# Altium schematic sheet fpgaB35.SchDoc
size A2; SheetNumber: 1; SheetTotal: 6
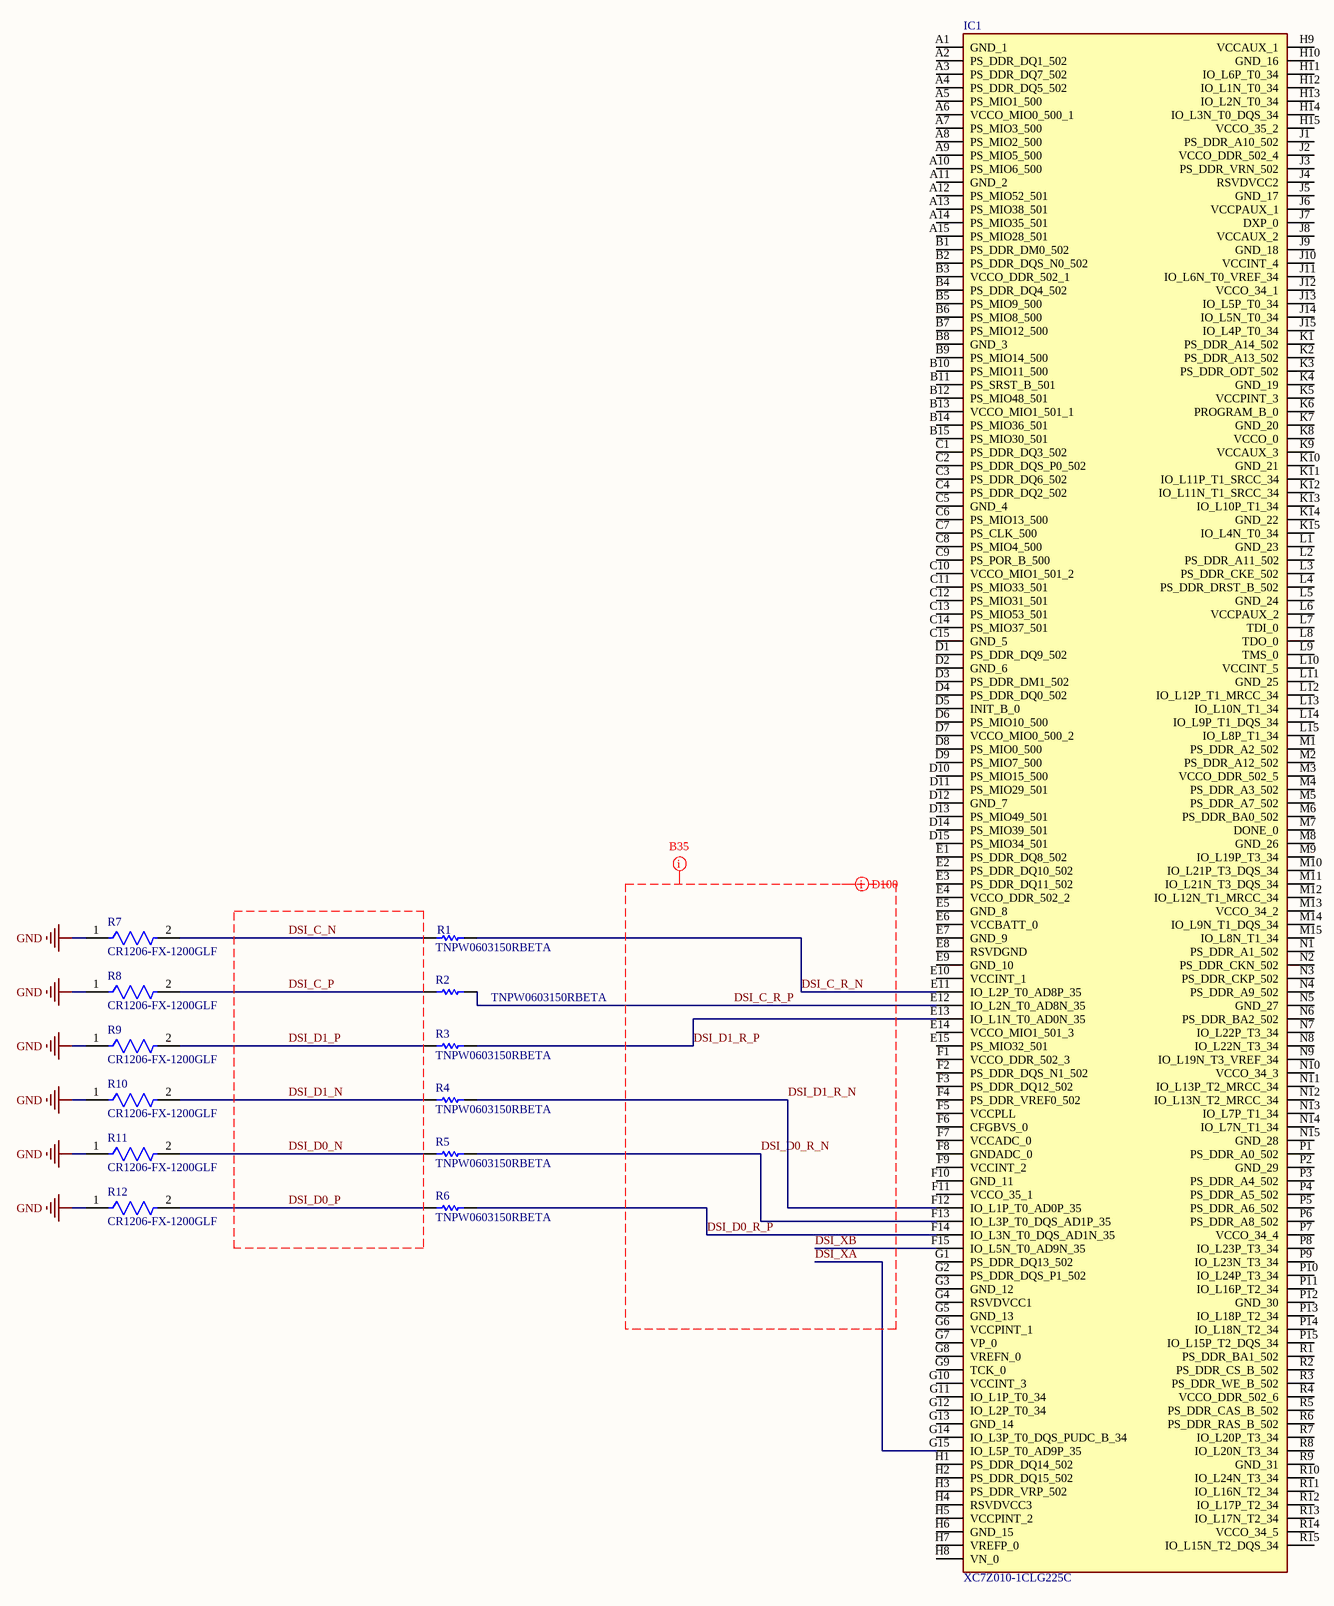
[diagram p0: fpgaB35.SchDoc]

## Parts
IC1  XC7Z010-1CLG225C  [BGA225C80P15X15_1300X1300X140]
R1  TNPW0603150RBETA  [RESC1609X55X30NL10T20]
R2  TNPW0603150RBETA  [RESC1609X55X30NL10T20]
R3  TNPW0603150RBETA  [RESC1609X55X30NL10T20]
R4  TNPW0603150RBETA  [RESC1609X55X30NL10T20]
R5  TNPW0603150RBETA  [RESC1609X55X30NL10T20]
R6  TNPW0603150RBETA  [RESC1609X55X30NL10T20]
R7  CR1206-FX-1200GLF  [FP-CR1206-MFG]
R8  CR1206-FX-1200GLF  [FP-CR1206-MFG]
R9  CR1206-FX-1200GLF  [FP-CR1206-MFG]
R10  CR1206-FX-1200GLF  [FP-CR1206-MFG]
R11  CR1206-FX-1200GLF  [FP-CR1206-MFG]
R12  CR1206-FX-1200GLF  [FP-CR1206-MFG]

## Nets
GND: R7.1 R8.1 R9.1 R10.1 R11.1 R12.1
DSI_C_N: R1.1 R7.2
DSI_C_P: R2.1 R8.2
DSI_C_R_N: IC1.E11(IO_L2P_T0_AD8P_35) R1.2
DSI_C_R_P: IC1.E12(IO_L2N_T0_AD8N_35) R2.2
DSI_D0_N: R5.1 R11.2
DSI_D0_P: R6.1 R12.2
DSI_D0_R_N: IC1.F13(IO_L3P_T0_DQS_AD1P_35) R5.2
DSI_D0_R_P: IC1.F14(IO_L3N_T0_DQS_AD1N_35) R6.2
DSI_D1_N: R4.1 R10.2
DSI_D1_P: R3.1 R9.2
DSI_D1_R_N: IC1.F12(IO_L1P_T0_AD0P_35) R4.2
DSI_D1_R_P: IC1.E13(IO_L1N_T0_AD0N_35) R3.2
DSI_XA: IC1.G15(IO_L5P_T0_AD9P_35)
DSI_XB: IC1.F15(IO_L5N_T0_AD9N_35)

Not connected (* = marked no-connect by the designer): IC1 A1(GND_1) A2(PS_DDR_DQ1_502) A3(PS_DDR_DQ7_502) A4(PS_DDR_DQ5_502) A5(PS_MIO1_500) A6(VCCO_MIO0_500_1) A7(PS_MIO3_500) A8(PS_MIO2_500) A9(PS_MIO5_500) A10(PS_MIO6_500) A11(GND_2) A12(PS_MIO52_501) A13(PS_MIO38_501) A14(PS_MIO35_501) A15(PS_MIO28_501) B1(PS_DDR_DM0_502) B2(PS_DDR_DQS_N0_502) B3(VCCO_DDR_502_1) B4(PS_DDR_DQ4_502) B5(PS_MIO9_500) B6(PS_MIO8_500) B7(PS_MIO12_500) B8(GND_3) B9(PS_MIO14_500) B10(PS_MIO11_500) B11(PS_SRST_B_501) B12(PS_MIO48_501) B13(VCCO_MIO1_501_1) B14(PS_MIO36_501) B15(PS_MIO30_501) C1(PS_DDR_DQ3_502) C2(PS_DDR_DQS_P0_502) C3(PS_DDR_DQ6_502) C4(PS_DDR_DQ2_502) C5(GND_4) C6(PS_MIO13_500) C7(PS_CLK_500) C8(PS_MIO4_500) C9(PS_POR_B_500) C10(VCCO_MIO1_501_2) C11(PS_MIO33_501) C12(PS_MIO31_501) C13(PS_MIO53_501) C14(PS_MIO37_501) C15(GND_5) D1(PS_DDR_DQ9_502) D2(GND_6) D3(PS_DDR_DM1_502) D4(PS_DDR_DQ0_502) D5(INIT_B_0) D6(PS_MIO10_500) D7(VCCO_MIO0_500_2) D8(PS_MIO0_500) D9(PS_MIO7_500) D10(PS_MIO15_500) D11(PS_MIO29_501) D12(GND_7) D13(PS_MIO49_501) D14(PS_MIO39_501) D15(PS_MIO34_501) E1(PS_DDR_DQ8_502) E2(PS_DDR_DQ10_502) E3(PS_DDR_DQ11_502) E4(VCCO_DDR_502_2) E5(GND_8) E6(VCCBATT_0) E7(GND_9) E8(RSVDGND) E9(GND_10) E10(VCCINT_1) E14(VCCO_MIO1_501_3) E15(PS_MIO32_501) F1(VCCO_DDR_502_3) F2(PS_DDR_DQS_N1_502) F3(PS_DDR_DQ12_502) F4(PS_DDR_VREF0_502) F5(VCCPLL) F6(CFGBVS_0) F7(VCCADC_0) F8(GNDADC_0) F9(VCCINT_2) F10(GND_11) F11(VCCO_35_1) G1(PS_DDR_DQ13_502) G2(PS_DDR_DQS_P1_502) G3(GND_12) G4(RSVDVCC1) G5(GND_13) G6(VCCPINT_1) G7(VP_0) G8(VREFN_0) G9(TCK_0) G10(VCCINT_3) G11(IO_L1P_T0_34) G12(IO_L2P_T0_34) G13(GND_14) G14(IO_L3P_T0_DQS_PUDC_B_34) H1(PS_DDR_DQ14_502) H2(PS_DDR_DQ15_502) H3(PS_DDR_VRP_502) H4(RSVDVCC3) H5(VCCPINT_2) H6(GND_15) H7(VREFP_0) H8(VN_0) H9(VCCAUX_1) H10(GND_16) H11(IO_L6P_T0_34) H12(IO_L1N_T0_34) H13(IO_L2N_T0_34) H14(IO_L3N_T0_DQS_34) H15(VCCO_35_2) J1(PS_DDR_A10_502) J2(VCCO_DDR_502_4) J3(PS_DDR_VRN_502) J4(RSVDVCC2) J5(GND_17) J6(VCCPAUX_1) J7(DXP_0) J8(VCCAUX_2) J9(GND_18) J10(VCCINT_4) J11(IO_L6N_T0_VREF_34) J12(VCCO_34_1) J13(IO_L5P_T0_34) J14(IO_L5N_T0_34) J15(IO_L4P_T0_34) K1(PS_DDR_A14_502) K2(PS_DDR_A13_502) K3(PS_DDR_ODT_502) K4(GND_19) K5(VCCPINT_3) K6(PROGRAM_B_0) K7(GND_20) K8(VCCO_0) K9(VCCAUX_3) K10(GND_21) K11(IO_L11P_T1_SRCC_34) K12(IO_L11N_T1_SRCC_34) K13(IO_L10P_T1_34) K14(GND_22) K15(IO_L4N_T0_34) L1(GND_23) L2(PS_DDR_A11_502) L3(PS_DDR_CKE_502) L4(PS_DDR_DRST_B_502) L5(GND_24) L6(VCCPAUX_2) L7(TDI_0) L8(TDO_0) L9(TMS_0) L10(VCCINT_5) L11(GND_25) L12(IO_L12P_T1_MRCC_34) L13(IO_L10N_T1_34) L14(IO_L9P_T1_DQS_34) L15(IO_L8P_T1_34) M1(PS_DDR_A2_502) M2(PS_DDR_A12_502) M3(VCCO_DDR_502_5) M4(PS_DDR_A3_502) M5(PS_DDR_A7_502) M6(PS_DDR_BA0_502) M7(DONE_0) M8(GND_26) M9(IO_L19P_T3_34) M10(IO_L21P_T3_DQS_34) M11(IO_L21N_T3_DQS_34) M12(IO_L12N_T1_MRCC_34) M13(VCCO_34_2) M14(IO_L9N_T1_DQS_34) M15(IO_L8N_T1_34) N1(PS_DDR_A1_502) N2(PS_DDR_CKN_502) N3(PS_DDR_CKP_502) N4(PS_DDR_A9_502) N5(GND_27) N6(PS_DDR_BA2_502) N7(IO_L22P_T3_34) N8(IO_L22N_T3_34) N9(IO_L19N_T3_VREF_34) N10(VCCO_34_3) N11(IO_L13P_T2_MRCC_34) N12(IO_L13N_T2_MRCC_34) N13(IO_L7P_T1_34) N14(IO_L7N_T1_34) N15(GND_28) P1(PS_DDR_A0_502) P2(GND_29) P3(PS_DDR_A4_502) P4(PS_DDR_A5_502) P5(PS_DDR_A6_502) P6(PS_DDR_A8_502) P7(VCCO_34_4) P8(IO_L23P_T3_34) P9(IO_L23N_T3_34) P10(IO_L24P_T3_34) P11(IO_L16P_T2_34) P12(GND_30) P13(IO_L18P_T2_34) P14(IO_L18N_T2_34) P15(IO_L15P_T2_DQS_34) R1(PS_DDR_BA1_502) R2(PS_DDR_CS_B_502) R3(PS_DDR_WE_B_502) R4(VCCO_DDR_502_6) R5(PS_DDR_CAS_B_502) R6(PS_DDR_RAS_B_502) R7(IO_L20P_T3_34) R8(IO_L20N_T3_34) R9(GND_31) R10(IO_L24N_T3_34) R11(IO_L16N_T2_34) R12(IO_L17P_T2_34) R13(IO_L17N_T2_34) R14(VCCO_34_5) R15(IO_L15N_T2_DQS_34)

## Layout directives
mark named B35: DSI_C_R_N, DSI_C_R_P, DSI_D0_R_N, DSI_D0_R_P, DSI_D1_R_N, DSI_D1_R_P, DSI_XA, DSI_XB
differential pair: DSI_C_R_N, DSI_C_R_P, DSI_D0_R_N, DSI_D0_R_P, DSI_D1_R_N, DSI_D1_R_P, DSI_XA, DSI_XB

## Library data of the parts
IC1 = XC7Z010-1CLG225C: Integrated Circuit; Manufacturer_Name: AMD; Datasheet Link: http://www.xilinx.com/support/documentation/user_guides/ug865-Zynq-7000-Pkg-Pinout.pdf; Height: 1.4mm; Manufacturer_Part_Number: XC7Z010-1CLG225C; Mouser Part Number: 217-XC7Z010-1CLG225C; Mouser Price/Stock: https://www.mouser.co.uk/ProductDetail/AMD-Xilinx/XC7Z010-1CLG225C?qs=rrS6PyfT74e2GV3C7gCLPw%3D%3D
R1-R6 = CMP-2000-03710-1: Manufacturer: Vishay Dale; Part Number: TNPW0603150RBETA
R7-R12 = CMP-07231-002551-1: Thick Film Chip Resistors 1206 120Ω 0.25W 1% 100ppm/°C; Max Power Dissipation: 250mW; Voltage Rating: 200V; Resistance: 120R; Case/Package: 1206; Length: 0.126inch; Features: Moisture Resistant; Temperature Coefficient: 100ppm/°C; Package Quantity: 10000; Packaging: Tape and Reel; Tolerance: 1%; Termination: SMD/SMT; Number of Terminations: 2; Radiation Hardening: No; Case Code (Metric): 3216; Composition: Thick Film; Max Operating Temperature: 155°C; Min Operating Temperature: -55°C; Case Code (Imperial): 1206; Mount: Surface Mount; Height: 0.03inch; Contact Plating: Tin; Width: 1.6mm; Thickness: 610um; Power Rating: 250mW